# EAGLE schematic LAYOUT (EAGLE 6.5.0)
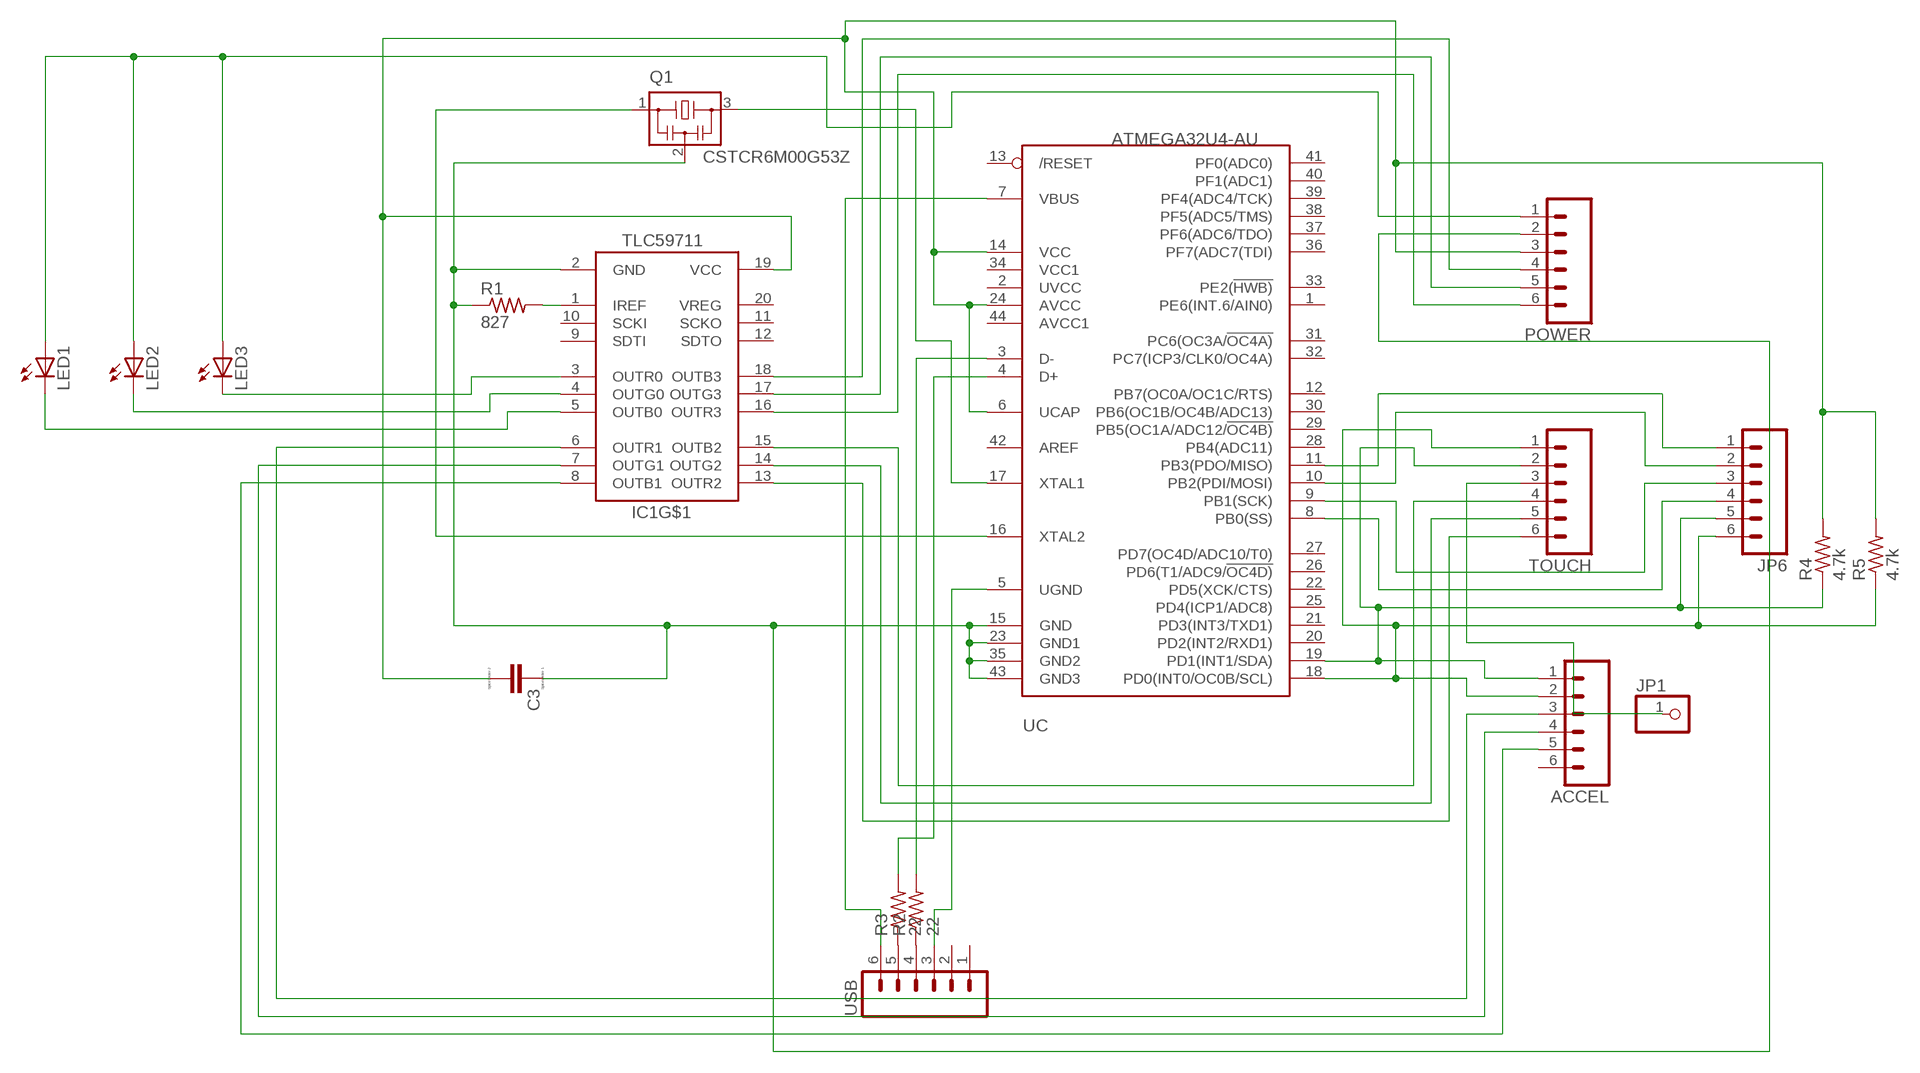
[diagram p0: schematic, sheet 1]

## Parts
ACCEL  M06SMD-STRAIGHT  [1X06_SMD_STRAIGHT]
C3  CC0603  [C0603]
IC1  TLC59711  [HTSSOP20DAP]
JP1  PINHD-1X1  [1X01]
JP6  M06SMD-STRAIGHT  [1X06_SMD_STRAIGHT]
LED1  LEDP-LCC-4  [P-LCC-4]
LED2  LEDP-LCC-4  [P-LCC-4]
LED3  LEDP-LCC-4  [P-LCC-4]
POWER  M06SMD-STRAIGHT  [1X06_SMD_STRAIGHT]
Q1  CSTCR6M00G53Z  [CSTCR6M]
R1  827  R-US_R0603  [R0603]
R2  22  R-US_R0603  [R0603]
R3  22  R-US_R0603  [R0603]
R4  4.7k  R-US_R0603  [R0603]
R5  4.7k  R-US_R0603  [R0603]
TOUCH  M06SMD-STRAIGHT  [1X06_SMD_STRAIGHT]
UC  ATMEGA32U4-AU  [TQFP44]
USB  M06SMD-STRAIGHT  [1X06_SMD_STRAIGHT]

## Nets
N$1: C3.1 IC1.2(GND) POWER.2 Q1.2 R1.1 UC.15(GND) UC.23(GND1) UC.35(GND2) UC.43(GND3)
N$2: IC1.1(IREF) R1.2
N$3: IC1.18(OUTB3) POWER.4
N$4: IC1.17(OUTG3) POWER.5
N$5: IC1.16(OUTR3) POWER.6
N$6: IC1.15(OUTB2) TOUCH.4
N$7: IC1.14(OUTG2) TOUCH.5
N$8: IC1.13(OUTR2) TOUCH.6
N$9: ACCEL.3 IC1.6(OUTR1)
N$10: ACCEL.4 IC1.7(OUTG1)
N$11: ACCEL.5 IC1.8(OUTB1)
N$12: UC.7(VBUS) USB.6
N$13: R2.2 UC.3(D-)
N$14: R3.2 UC.4(D+)
N$15: UC.5(UGND) USB.3
N$16: R2.1 USB.4
N$17: R3.1 USB.5
N$18: Q1.3 UC.17(XTAL1)
N$19: Q1.1 UC.16(XTAL2)
N$21: JP6.2 UC.10(PB2(PDI/MOSI))
N$23: JP6.3 UC.9(PB1(SCK))
N$24: JP6.4 UC.8(PB0(SS))
N$25: IC1.3(OUTR0) LED3.C@4(C)
N$26: IC1.4(OUTG0) LED2.C@4(C)
N$27: IC1.5(OUTB0) LED1.C@4(C)
N$28: LED1.A LED2.A LED3.A POWER.1
N$29: ACCEL.1 JP6.5 R4.1 TOUCH.2 UC.19(PD1(INT1/SDA))
N$30: ACCEL.2 JP6.6 R5.1 TOUCH.1 UC.18(PD0(INT0/OC0B/SCL))
N$31: JP6.1 UC.11(PB3(PDO/MISO))
N$33: JP1.1 TOUCH.3
N$35: C3.2 IC1.19(VCC) POWER.3 R4.2 R5.2 UC.6(UCAP) UC.14(VCC) UC.24(AVCC)
Unconnected: ACCEL.6 IC1.9(SDTI) IC1.10(SCKI) IC1.11(SCKO) IC1.12(SDTO) IC1.20(VREG) IC1.EXP(PAD) UC.1(PE6(INT.6/AIN0)) UC.2(UVCC) UC.12(PB7(OC0A/OC1C/RTS)) UC.13(/RESET) UC.20(PD2(INT2/RXD1)) UC.21(PD3(INT3/TXD1)) UC.22(PD5(XCK/CTS)) UC.25(PD4(ICP1/ADC8)) UC.26(PD6(T1/ADC9/!OC4D)) UC.27(PD7(OC4D/ADC10/T0)) UC.28(PB4(ADC11)) UC.29(PB5(OC1A/ADC12/!OC4B)) UC.30(PB6(OC1B/OC4B/ADC13)) UC.31(PC6(OC3A/!OC4A)) UC.32(PC7(ICP3/CLK0/OC4A)) UC.33(PE2(!HWB)) UC.34(VCC1) UC.36(PF7(ADC7(TDI)) UC.37(PF6(ADC6/TDO)) UC.38(PF5(ADC5/TMS)) UC.39(PF4(ADC4/TCK)) UC.40(PF1(ADC1)) UC.41(PF0(ADC0)) UC.42(AREF) UC.44(AVCC1) USB.1 USB.2

## Library data of the parts
ACCEL JP6 POWER TOUCH USB = SparkFun-Connectors:M06: Header 6 Standard 6-pin 0.1" header. Use with straight break away headers (SKU : PRT-00116), right angle break away headers (PRT-00553), swiss pins (PRT-00743), machine pins (PRT-00117), and female headers (PRT-00115). Molex polarized connector foot print use with SKU : PRT-08094 with associated crimp pins and housings. NOTES ON THE VARIANTS LOCK and LOCK_LONGPADS... This footprint was designed to help hold the alignment of a through-hole component (i.e. 6-pin header) while soldering it into place. You may notice that each hole has been shifted either up or down by 0.005 of an inch from it's more standard position (which is a perfectly straight line). This slight alteration caused the pins (the squares in the middle) to touch the edges of the holes. Because they are alternating, it causes a "brace" to hold the component in place. 0.005 has proven to be the perfect amount of "off-center" position when using our standard breakaway headers. Although looks a little odd when you look at the bare footprint, once you have a header in there, the alteration is very hard to notice. Also,if you push a header all the way into place, it is covered up entirely on the bottom side. This idea of altering the position of holes to aid alignment will be further integrated into the Sparkfun Library for other footprints. It can help hold any component with 3 or more connection pins.
C3 = eagle-ltspice:C: CAPACITOR, European symbol; SPICEMODEL: NONE; SPICEPREFIX: C
IC1 = adafruit:TLC59711
JP1 = pinhead:PINHD-1X1: PIN HEADER
LED1-LED3 = led:LED: LED OSRAM: - CHIPLED LG R971, LG N971, LY N971, LG Q971, LY Q971, LO R971, LY R971 LH N974, LH R974 LS Q976, LO Q976, LY Q976 LO Q996 - Hyper CHIPLED LW Q18S LB Q993, LB Q99A, LB R99A - SideLED LS A670, LO A670, LY A670, LG A670, LP A670 LB A673, LV A673, LT A673, LW A673 LH A674 LY A675 LS A676, LA A676, LO A676, LY A676, LW A676 LS A679, LY A679, LG A679 - Hyper Micro SIDELED® LS Y876, LA Y876, LO Y876, LY Y876 LT Y87S - SmartLED LW L88C, LW L88S LB L89C, LB L89S, LG L890 LS L89K, LO L89K, LY L89K LS L896, LA L896, LO L896, LY L896 - TOPLED LS T670, LO T670, LY T670, LG T670, LP T670 LSG T670, LSP T670, LSY T670, LOP T670, LYG T670 LG T671, LOG T671, LSG T671 LB T673, LV T673, LT T673, LW T673 LH T674 LS T676, LA T676, LO T676, LY T676, LB T676, LH T676, LSB T676, LW T676 LB T67C, LV T67C, LT T67C, LS T67K, LO T67K, LY T67K, LW E67C LS E67B, LA E67B, LO E67B, LY E67B, LB E67C, LV E67C, LT E67C LW T67C LS T679, LY T679, LG T679 LS T770, LO T770, LY T770, LG T770, LP T770 LB T773, LV T773, LT T773, LW T773 LH T774 LS E675, LA E675, LY E675, LS T675 LS T776, LA T776, LO T776, LY T776, LB T776 LHGB T686 LT T68C, LB T68C - Hyper Mini TOPLED® LB M676 - Mini TOPLED Santana® LG M470 LS M47K, LO M47K, LY M47K Source: http://www.osram.convergy.de LUXEON: - LUMILED® LXK2-PW12-R00, LXK2-PW12-S00, LXK2-PW14-U00, LXK2-PW14-V00 LXK2-PM12-R00, LXK2-PM12-S00, LXK2-PM14-U00 LXK2-PE12-Q00, LXK2-PE12-R00, LXK2-PE12-S00, LXK2-PE14-T00, LXK2-PE14-U00 LXK2-PB12-K00, LXK2-PB12-L00, LXK2-PB12-M00, LXK2-PB14-N00, LXK2-PB14-P00, LXK2-PB14-Q00 LXK2-PR12-L00, LXK2-PR12-M00, LXK2-PR14-Q00, LXK2-PR14-R00 LXK2-PD12-Q00, LXK2-PD12-R00, LXK2-PD12-S00 LXK2-PH12-R00, LXK2-PH12-S00 LXK2-PL12-P00, LXK2-PL12-Q00, LXK2-PL12-R00 Source: www.luxeon.com KINGBRIGHT: KA-3528ASYC Source: www.kingbright.com
Q1 = murata-filter:CSTCR: Resonator Source: murata.co.jp; MPN: CSTCR6M00G53-R0; OC_FARNELL: 1170434; OC_NEWARK: 25M8759
R1-R5 = resistor:R-US_: RESISTOR, American symbol
UC = adafruit:ATMEGA32U4: http://www.ladyada.net/library/eagle